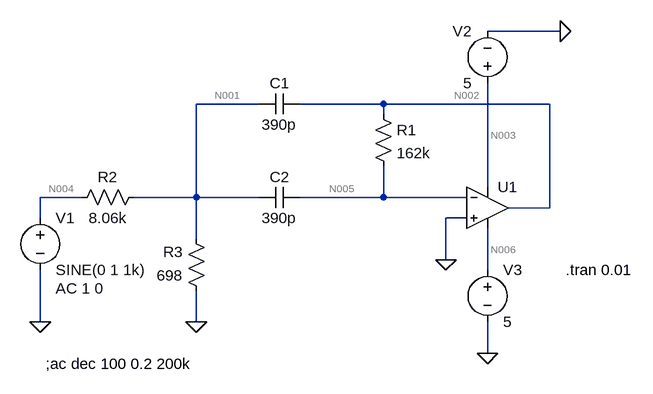
[diagram p0: schematic HighFreq.asc]
HighFreq.asc, the LTspice schematic file:
Version 4
SHEET 1 880 680
WIRE 528 -16 416 -16
WIRE 64 96 -32 96
WIRE 256 96 128 96
WIRE 512 96 256 96
WIRE 256 112 256 96
WIRE 416 224 416 64
WIRE -208 240 -272 240
WIRE -32 240 -32 96
WIRE -32 240 -128 240
WIRE 64 240 -32 240
WIRE 256 240 256 192
WIRE 256 240 128 240
WIRE 384 240 256 240
WIRE 512 256 512 96
WIRE 512 256 448 256
WIRE -272 272 -272 240
WIRE 384 272 352 272
WIRE -32 304 -32 240
WIRE 352 336 352 272
WIRE 416 352 416 288
WIRE -272 432 -272 352
WIRE -32 432 -32 384
WIRE 416 480 416 432
FLAG -32 432 0
FLAG 352 336 0
FLAG -272 432 0
FLAG 528 -16 0
FLAG 416 480 0
SYMBOL cap 128 80 R90
WINDOW 0 0 32 VBottom 2
WINDOW 3 32 32 VTop 2
SYMATTR InstName C1
SYMATTR Value 390p
SYMBOL cap 128 224 R90
WINDOW 0 0 32 VBottom 2
WINDOW 3 32 32 VTop 2
SYMATTR InstName C2
SYMATTR Value 390p
SYMBOL res 240 96 R0
SYMATTR InstName R1
SYMATTR Value 162k
SYMBOL res -112 224 R90
WINDOW 0 0 56 VBottom 2
WINDOW 3 32 56 VTop 2
SYMATTR InstName R2
SYMATTR Value 8.06k
SYMBOL res -16 400 R180
WINDOW 0 36 76 Left 2
WINDOW 3 36 40 Left 2
SYMATTR InstName R3
SYMATTR Value 698
SYMBOL OpAmps\\UniversalOpAmp1 416 256 R0
SYMATTR InstName U1
SYMBOL voltage -272 256 R0
WINDOW 123 24 124 Left 2
WINDOW 39 0 0 Left 0
SYMATTR Value2 AC 1 0
SYMATTR InstName V1
SYMATTR Value SINE(0 1 1k)
SYMBOL voltage 416 80 R180
WINDOW 0 24 96 Left 2
WINDOW 3 24 16 Left 2
WINDOW 123 0 0 Left 0
WINDOW 39 0 0 Left 0
SYMATTR InstName V2
SYMATTR Value 5
SYMBOL voltage 416 336 R0
WINDOW 123 0 0 Left 0
WINDOW 39 0 0 Left 0
SYMATTR InstName V3
SYMATTR Value 5
TEXT -264 496 Left 2 !;ac dec 100 0.2 200k
TEXT 536 352 Left 2 !.tran 0.01

The netlist it stands for:
* HighFreq.asc
C1 N002 N001 390p
C2 N005 N001 390p
R1 N002 N005 162k
R2 N001 N004 8.06k
R3 0 N001 698
XU1 0 N005 N003 N006 N002 level1 Avol=1Meg GBW=10Meg Vos=0 En=0 Enk=0 In=0 Ink=0 Rin=500Meg  ; pins In+ In- V+ V- OUT
V1 N004 0 SINE(0 1 1k) AC 1 0
V2 N003 0 5
V3 N006 0 5
;ac dec 100 0.2 200k
.tran 0.01
.lib UniversalOpAmp1.lib
.backanno
.end

* Results of the author's LTspice run, read from the files saved beside the schematic
* Operating Point, zero values left out:
*   V(n002) = -1.62 mV
*   V(n003) = 5 V
*   V(n006) = 5 V
*   I(R1) = -10 nA
*   I(V3) = -10 nA
*   I(V2) = -10 nA
*   Ix(u1:1) = -10 nA
*   Ix(u1:2) = -10 nA
*   Ix(u1:3) = 10 nA
*   Ix(u1:4) = 10 nA
*   Ix(u1:5) = 11.04 nA
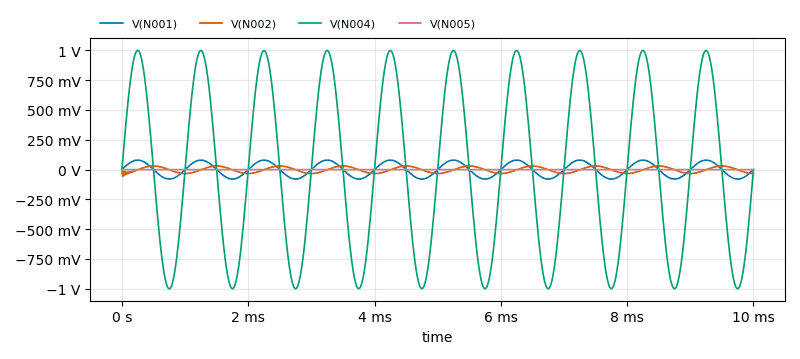
[diagram p1: Transient Analysis of HighFreq.asc, plotted from the saved traces]
* Transient Analysis, 1 run:
*   V(N001): min -79.67 mV, max 79.72 mV, average 1.485 µV, rms 56.34 mV, last -251.1 µV
*   V(N002): min -57 mV, max 30.07 mV, average -1.615 mV, rms 22.46 mV, last -33.29 mV
*   V(N004): min -1 V, max 1 V, average 16.62 µV, rms 707.1 mV, last 0 V
*   V(N005): min -84.99 µV, max 106.8 µV, average 57.6 nV, rms 5.32 µV, last 32.66 nV